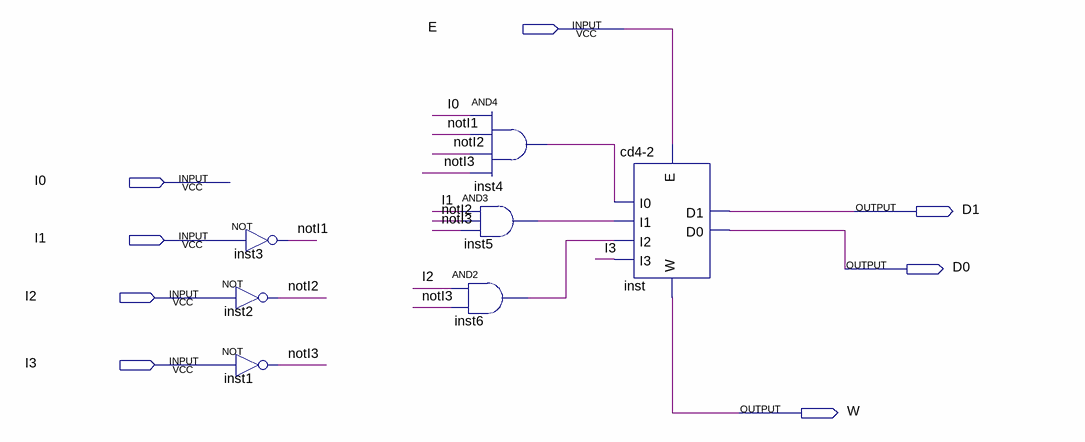
[diagram p0: schematic sheet]
// Quartus schematic pcd4-2.bdf as structural Verilog: 7 symbols, 8 pins
module \pcd4-2  (
  input  E,
  input  I0,
  input  I1,
  input  I2,
  input  I3,
  output D1,
  output D0,
  output W
);

  wire inst4_out, inst5_out, inst6_out, notI1, notI2, notI3;

  not inst2 (notI2, I2);
  not inst1 (notI3, I3);
  not inst3 (notI1, I1);
  and inst6 (inst6_out, I2, notI3);
  and inst4 (inst4_out, I0, notI1, notI2, notI3);
  and inst5 (inst5_out, I1, notI2, notI3);
  \cd4-2  inst (.E(E), .I0(inst4_out), .I1(inst5_out), .I2(inst6_out), .I3(I3), .D1(D1), .D0(D0), .W(W));
endmodule
